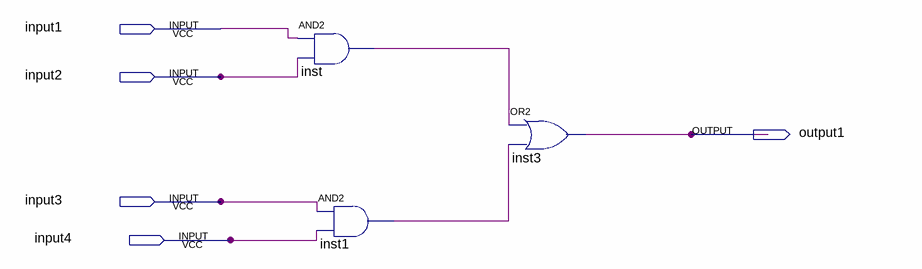
[diagram p0: schematic sheet]
// Quartus schematic HelloWorldDiagram.bdf as structural Verilog: 3 symbols, 5 pins
module HelloWorldDiagram (
  input  input1,
  input  input2,
  input  input3,
  input  input4,
  output output1
);

  wire inst1_out, inst_out;

  and inst (inst_out, input1, input2);
  and inst1 (inst1_out, input3, input4);
  or inst3 (output1, inst_out, inst1_out);
endmodule
